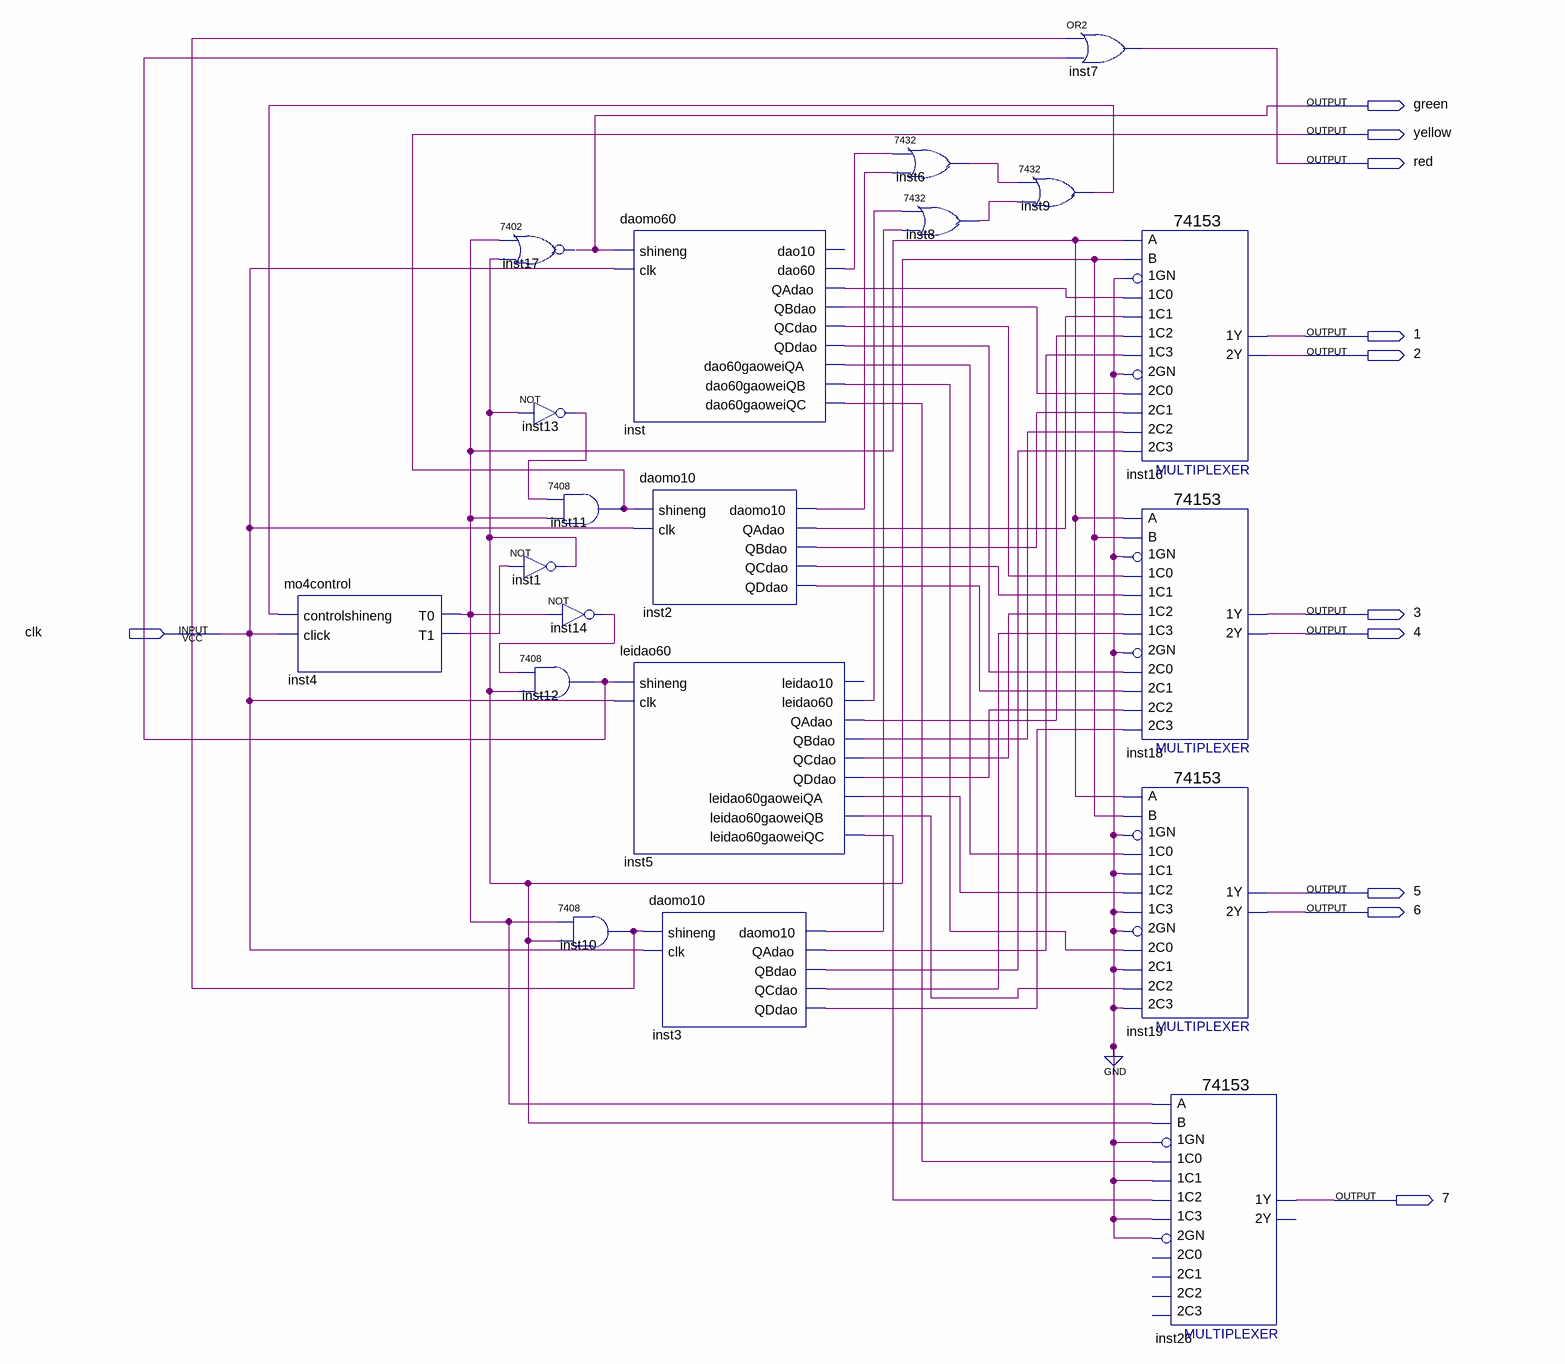
[diagram p0: schematic sheet]
// Quartus schematic southnorth.bdf as structural Verilog: 20 symbols, 11 pins
module southnorth (
  input  clk,
  output green,
  output yellow,
  output red,
  output \1 ,
  output \2 ,
  output \3 ,
  output \4 ,
  output \5 ,
  output \6 ,
  output \7 
);

  wire inst1_out, inst2_daomo10, inst2_qadao, inst2_qbdao, inst2_qcdao, inst2_qddao, inst3_daomo10,
       inst3_qadao, inst3_qbdao, inst3_qcdao, inst3_qddao, inst4_t0, inst4_t1, inst5_leidao60,
       inst5_leidao60gaoweiqa, inst5_leidao60gaoweiqb, inst5_leidao60gaoweiqc, inst5_qadao, inst5_qbdao,
       inst5_qcdao, inst5_qddao, inst6_1, inst8_1, inst9_1, inst10_1, inst12_1, inst13_out, inst14_out,
       inst_dao60, inst_dao60gaoweiqa, inst_dao60gaoweiqb, inst_dao60gaoweiqc, inst_qadao, inst_qbdao,
       inst_qcdao, inst_qddao;

  mo4control inst4 (.controlshineng(inst9_1), .click(clk), .T0(inst4_t0), .T1(inst4_t1));
  \7402  inst17 (.\2 (inst4_t0), .\3 (inst1_out), .\1 (green));
  not inst13 (inst13_out, inst1_out);
  not inst1 (inst1_out, inst4_t1);
  \7408  inst12 (.\3 (inst1_out), .\2 (inst14_out), .\1 (inst12_1));
  daomo60 inst (
    .shineng(green), .clk(clk), .dao60(inst_dao60), .QAdao(inst_qadao), .QBdao(inst_qbdao),
    .QCdao(inst_qcdao), .QDdao(inst_qddao), .dao60gaoweiQA(inst_dao60gaoweiqa),
    .dao60gaoweiQB(inst_dao60gaoweiqb), .dao60gaoweiQC(inst_dao60gaoweiqc));  // open: dao10
  \7408  inst11 (.\3 (inst4_t0), .\2 (inst13_out), .\1 (yellow));
  not inst14 (inst14_out, inst4_t0);
  leidao60 inst5 (
    .shineng(inst12_1), .clk(clk), .leidao60(inst5_leidao60), .QAdao(inst5_qadao), .QBdao(inst5_qbdao),
    .QCdao(inst5_qcdao), .QDdao(inst5_qddao), .leidao60gaoweiQA(inst5_leidao60gaoweiqa),
    .leidao60gaoweiQB(inst5_leidao60gaoweiqb), .leidao60gaoweiQC(inst5_leidao60gaoweiqc));  // open: leidao10
  \7408  inst10 (.\3 (inst1_out), .\2 (inst4_t0), .\1 (inst10_1));
  daomo10 inst2 (
    .shineng(yellow), .clk(clk), .daomo10(inst2_daomo10), .QAdao(inst2_qadao), .QBdao(inst2_qbdao),
    .QCdao(inst2_qcdao), .QDdao(inst2_qddao));
  daomo10 inst3 (
    .shineng(inst10_1), .clk(clk), .daomo10(inst3_daomo10), .QAdao(inst3_qadao), .QBdao(inst3_qbdao),
    .QCdao(inst3_qcdao), .QDdao(inst3_qddao));
  \7432  inst6 (.\2 (inst_dao60), .\3 (inst2_daomo10), .\1 (inst6_1));
  \7432  inst8 (.\2 (inst5_leidao60), .\3 (inst3_daomo10), .\1 (inst8_1));
  or inst7 (red, inst10_1, inst12_1);
  \7432  inst9 (.\2 (inst6_1), .\3 (inst8_1), .\1 (inst9_1));
  \74153  inst16 (
    .\1C1 (inst2_qadao), .\1GN (1'b0), .\1C0 (inst_qadao), .\2C0 (inst_qbdao), .\2GN (1'b0),
    .\2C2 (inst5_qbdao), .\1C2 (inst5_qadao), .\1C3 (inst3_qadao), .B(inst1_out), .A(inst4_t0),
    .\2C1 (inst2_qbdao), .\2C3 (inst3_qbdao), .\1Y (\1 ), .\2Y (\2 ));
  \74153  inst18 (
    .\1C1 (inst2_qcdao), .\1GN (1'b0), .\1C0 (inst_qcdao), .\2C0 (inst_qddao), .\2GN (1'b0),
    .\2C2 (inst5_qddao), .\1C2 (inst5_qcdao), .\1C3 (inst3_qcdao), .B(inst1_out), .A(inst4_t0),
    .\2C1 (inst2_qddao), .\2C3 (inst3_qddao), .\1Y (\3 ), .\2Y (\4 ));
  \74153  inst19 (
    .\1C1 (1'b0), .\1GN (1'b0), .\1C0 (inst_dao60gaoweiqa), .\2C0 (inst_dao60gaoweiqb), .\2GN (1'b0),
    .\2C2 (inst5_leidao60gaoweiqb), .\1C2 (inst5_leidao60gaoweiqa), .\1C3 (1'b0), .B(inst1_out),
    .A(inst4_t0), .\2C1 (1'b0), .\2C3 (1'b0), .\1Y (\5 ), .\2Y (\6 ));
  \74153  inst26 (
    .\1C1 (1'b0), .\1GN (1'b0), .\1C0 (inst_dao60gaoweiqc), .\2GN (1'b0), .\1C2 (inst5_leidao60gaoweiqc),
    .\1C3 (1'b0), .B(inst1_out), .A(inst4_t0), .\1Y (\7 ));  // open: 2C0, 2C2, 2C1, 2C3, 2Y
endmodule
